# EAGLE schematic vibrator_brick (EAGLE 7.2.0)
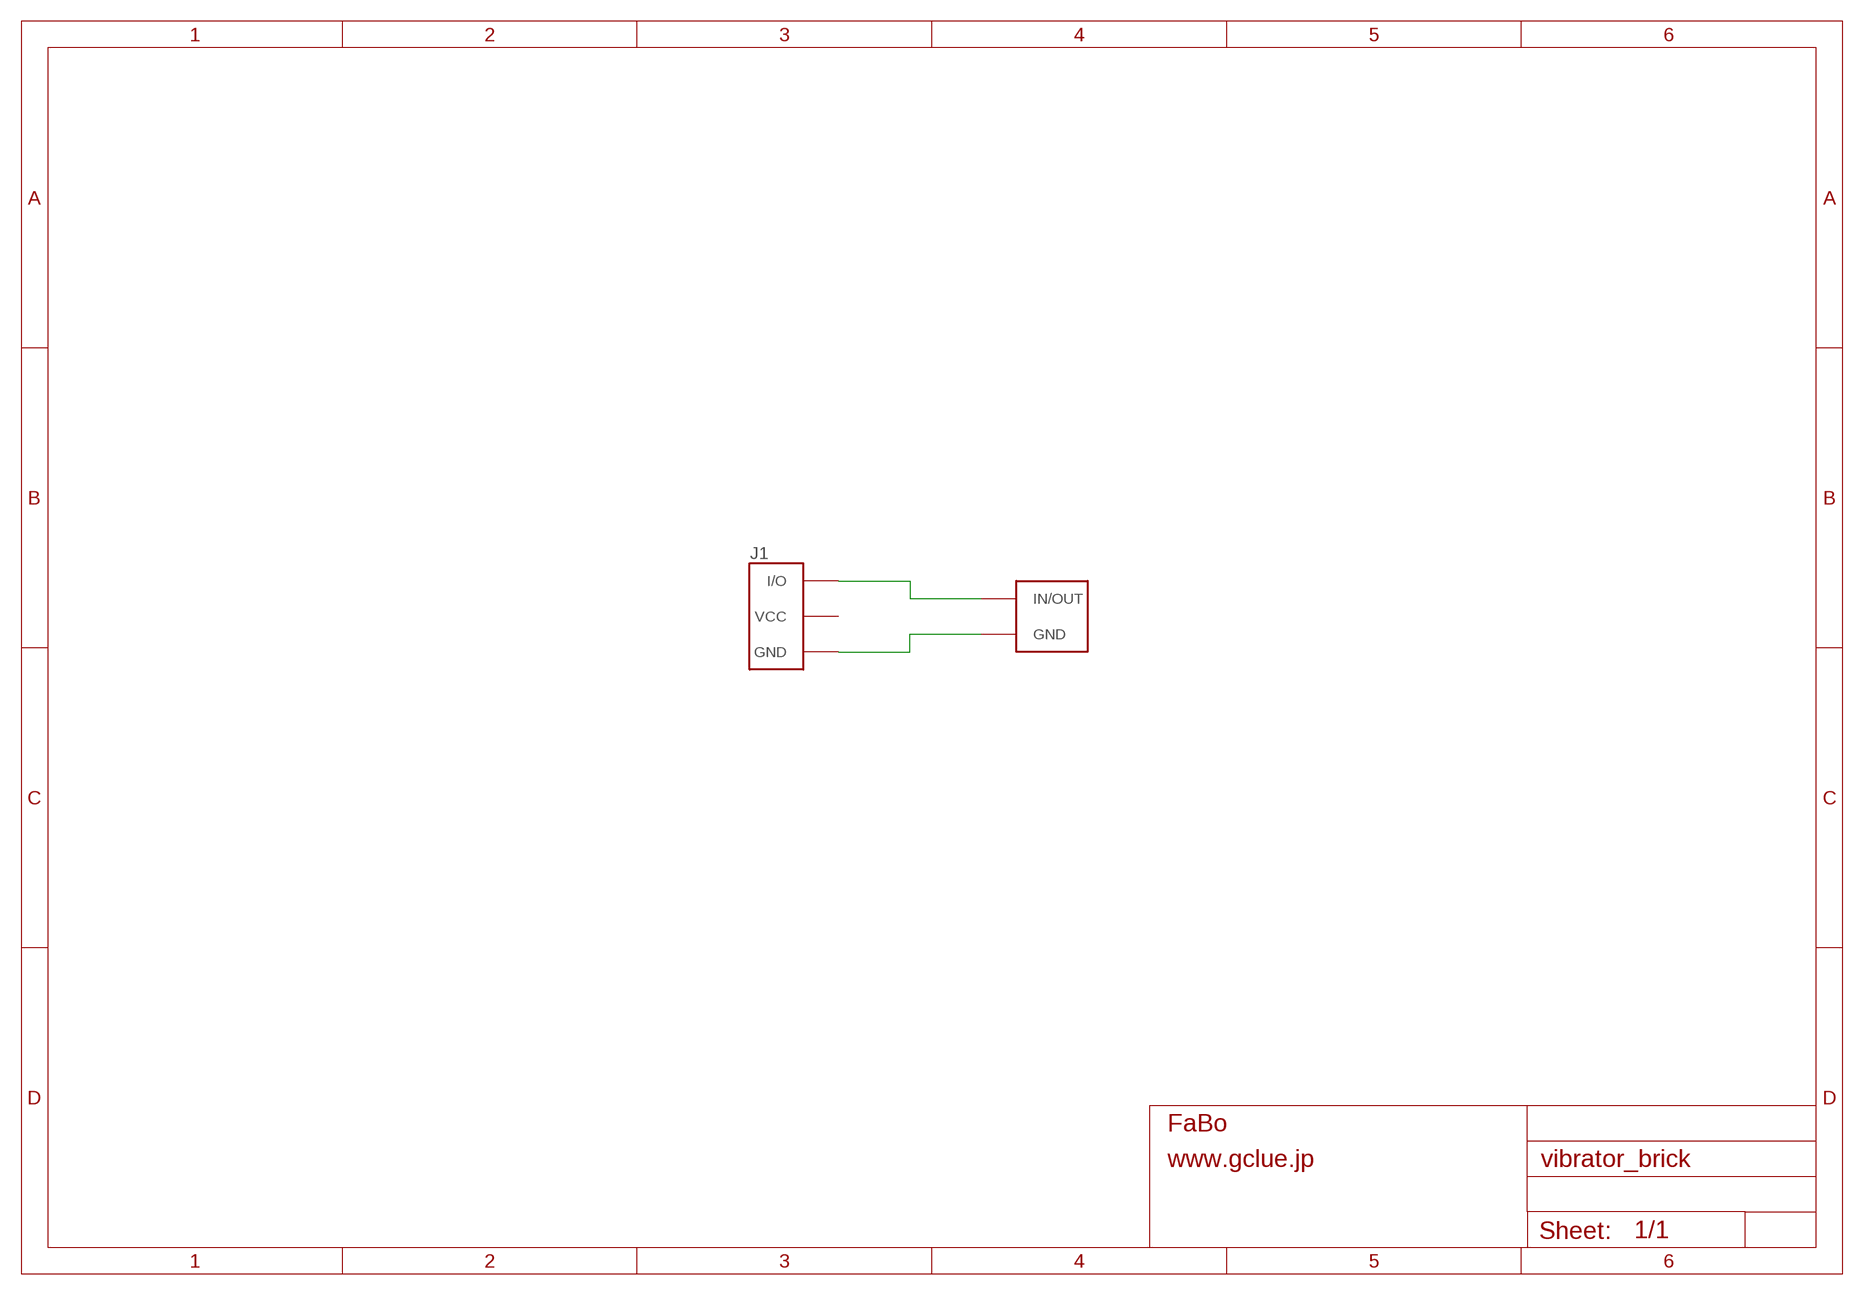
[diagram p0: schematic, sheet 1]

## Parts
J1  BRICK_3PIN  [BRICK_3PIN]
U$1  VIBRATOR-LA3R5-480H1  [VIBRATOR-LA3R5-480H1]

## Nets
GND: J1.GND U$1.P$2(GND)
N$1: J1.IN/OUT(I/O) U$1.P$1(IN/OUT)
Unconnected: J1.VCC

## Library data of the parts
J1 = gclue:BRICK_3PIN: FaBo Brick 3pin
U$1 = gclue:VIBRATOR-LA3R5-480H1